# EAGLE schematic receiving end (EAGLE 6.3)
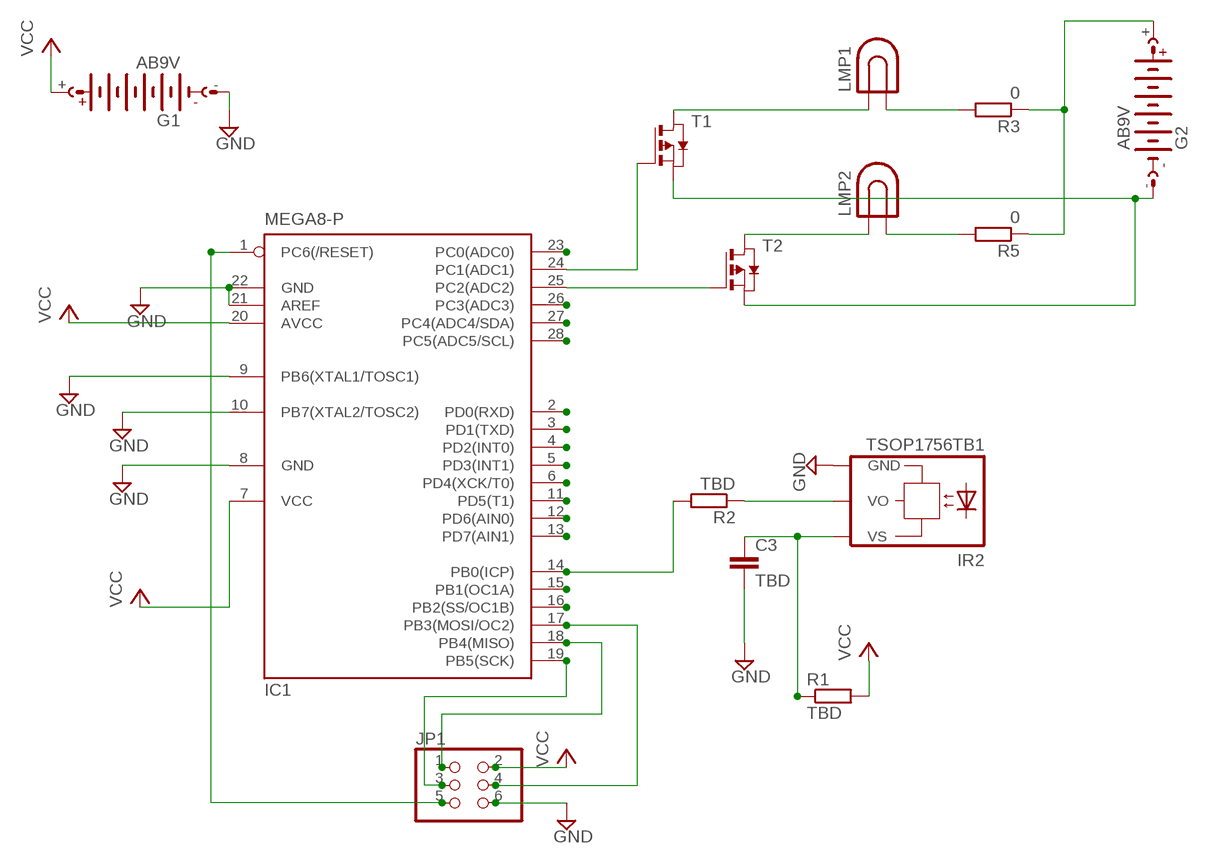
[diagram p0: schematic, sheet 1]

## Parts
C3  TBD  C-EUC0805  [C0805]
G1  AB9V  [AB9V]
G2  AB9V  [AB9V]
IC1  MEGA8-P  [DIL28-3]
IR2  TSOP1756TB1  [TSOP17_TB1]
JP1  PINHD-2X3  [2X03]
LMP1  LAMP  [LDH-5R]
LMP2  LAMP  [LDH-5R]
R1  TBD  R-EU_R0805  [R0805]
R2  TBD  R-EU_R0805  [R0805]
R3  0  R-EU_R0805  [R0805]
R5  0  R-EU_R0805  [R0805]
T1  PMOSSOT23ZXM61P02FTA  [SOT-23]
T2  PMOSSOT23ZXM61P02FTA  [SOT-23]

## Nets
GND: C3.2 G1.- IC1.8(GND) IC1.9(PB6(XTAL1/TOSC1)) IC1.10(PB7(XTAL2/TOSC2)) IC1.21(AREF) IC1.22(GND) IR2.GND JP1.6
N$1: IC1.25(PC2(ADC2)) T2.3(G)
N$2: IC1.26(PC3(ADC3))
N$3: IC1.11(PD5(T1))
N$4: IR2.VO R2.1
N$5: LMP1.1 T1.1(D)
N$6: LMP1.2 R3.2
N$7: LMP2.1 T2.1(D)
N$8: G2.- T1.2(S) T2.2(S)
N$9: G2.+ R3.1 R5.1
N$10: LMP2.2 R5.2
N$11: IC1.24(PC1(ADC1)) T1.3(G)
N$12: C3.1 IR2.VS R1.1
N$15: IC1.23(PC0(ADC0))
N$16: IC1.27(PC4(ADC4/SDA))
N$17: IC1.28(PC5(ADC5/SCL))
N$18: IC1.2(PD0(RXD))
N$19: IC1.3(PD1(TXD))
N$20: IC1.4(PD2(INT0))
N$21: IC1.5(PD3(INT1))
N$22: IC1.6(PD4(XCK/T0))
N$23: IC1.12(PD6(AIN0))
N$24: IC1.13(PD7(AIN1))
N$25: IC1.14(PB0(ICP)) R2.2
N$26: IC1.15(PB1(OC1A))
N$27: IC1.16(PB2(SS/OC1B))
N$28: IC1.17(PB3(MOSI/OC2)) JP1.4
N$29: IC1.18(PB4(MISO)) JP1.1
N$30: IC1.19(PB5(SCK)) JP1.3
N$35: IC1.1(PC6(/RESET)) JP1.5
VCC: G1.+ IC1.7(VCC) IC1.20(AVCC) JP1.2 R1.2

## Library data of the parts
C3 = rcl:C-EU: CAPACITOR, European symbol
G1 G2 = battery:AB9V: 9-V BATTERY CLIP
IC1 = atmel:MEGA8-P: MICROCONTROLLER 8 Kbytes FLASH, 1 kbytes SRAM, 512 bytes EEPROM, USART, 4-channel 10 bit ADC, 2-channel 8 bit ADC Pin compatible with Atmega48, ATMega88, ATMega168 Source: avr.lbr; OC_FARNELL: unknown; OC_NEWARK: unknown
IR2 = telefunken:TSOP17*TB1: TSOP17..TB1 IR Receiver Modules for Remote Control Systems Source: http://www.vishay.com/docs/82042/82042.pdf; OC_FARNELL: unknown; OC_NEWARK: unknown
JP1 = pinhead:PINHD-2X3: PIN HEADER
LMP1 LMP2 = special:LAMP: LED HOLDER
R1-R3 R5 = resistor:R-EU_: RESISTOR, European symbol
T1 T2 = solomon_library:PMOSSOT23: MOS FET; OC_FARNELL: unknown; OC_NEWARK: unknown